# EAGLE design OwlClock2 (EAGLE 7.5.0)

## Sheet 1 of 3
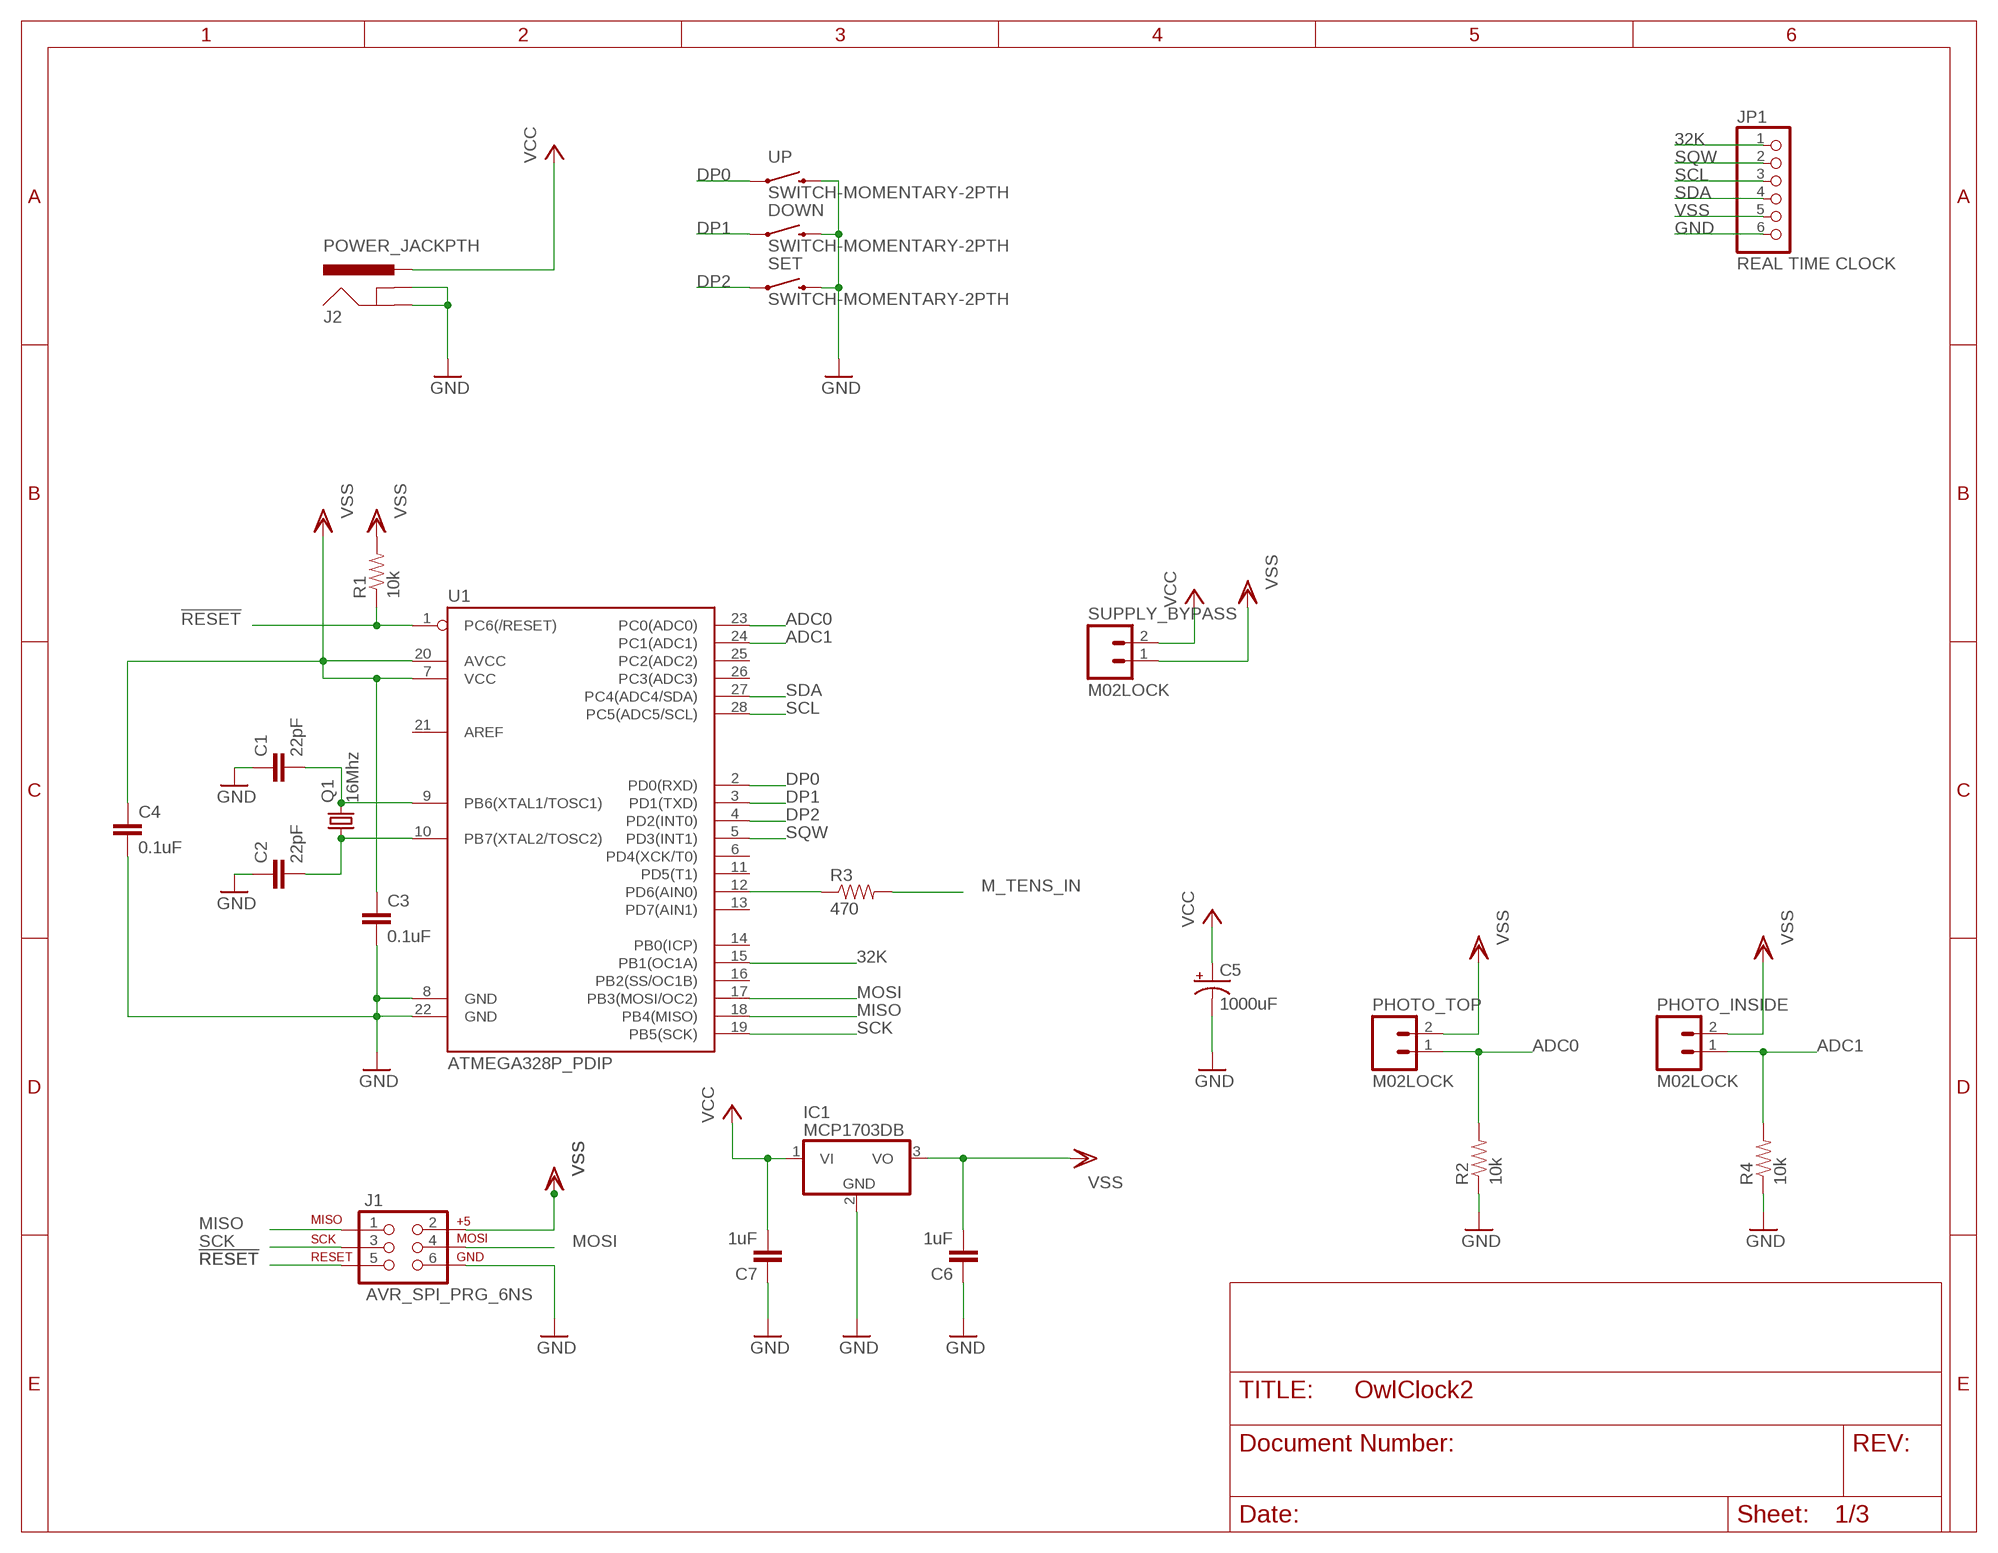
[diagram p0: schematic, sheet 1]

### Parts
C1  22pF  0.1UF-25V(+80/-20%)(0603)  [0603-CAP]
C2  22pF  0.1UF-25V(+80/-20%)(0603)  [0603-CAP]
C3  0.1uF  0.1UF-25V(+80/-20%)(0603)  [0603-CAP]
C4  0.1uF  0.1UF-25V(+80/-20%)(0603)  [0603-CAP]
C5  1000uF  CAP_POLPTH4  [CPOL-RADIAL-1000UF-25V]
C6  1uF  0.1UF-25V(+80/-20%)(0603)  [0603-CAP]
C7  1uF  0.1UF-25V(+80/-20%)(0603)  [0603-CAP]
DOWN  SWITCH-MOMENTARY-2PTH  [TACTILE-PTH]
IC1  MCP1703DB  [SOT223]
J1  AVR_SPI_PRG_6NS  [2X3-NS]
J2  POWER_JACKPTH  [POWER_JACK_PTH]
JP1  REAL TIME CLOCK  PINHD-1X6  [1X06]
PHOTO_INSIDE  M02LOCK  [1X02_LOCK]
PHOTO_TOP  M02LOCK  [1X02_LOCK]
Q1  16Mhz  CRYSTALHC18U-V  [HC18U-V]
R1  10k  0.22OHM1/4W1%(0805)  [0805]
R2  10k  0.22OHM1/4W1%(0805)  [0805]
R3  470  0.22OHM1/4W1%(0805)  [0805]
R4  10k  0.22OHM1/4W1%(0805)  [0805]
SET  SWITCH-MOMENTARY-2PTH  [TACTILE-PTH]
SUPPLY_BYPASS  M02LOCK  [1X02_LOCK]
U1  ATMEGA328P_PDIP  [DIL28-3]
UP  SWITCH-MOMENTARY-2PTH  [TACTILE-PTH]

### Nets
32K: JP1.1 U1.15(PB1(OC1A))
!RESET: J1.5 R1.1 U1.1(PC6(/RESET))
ADC0: PHOTO_TOP.1 R2.2 U1.23(PC0(ADC0))
ADC1: PHOTO_INSIDE.1 R4.2 U1.24(PC1(ADC1))
DP0: U1.2(PD0(RXD)) UP.1
DP1: DOWN.1 U1.3(PD1(TXD))
DP2: SET.1 U1.4(PD2(INT0))
GND: C1.1 C2.1 C3.2 C4.2 C5.2(-) C6.1 C7.1 DOWN.3 IC1.2(GND) J1.6 J2.GND J2.GNDBREAK JP1.6 R2.1 R4.1 SET.3 U1.8(GND) U1.22(GND) UP.3 ; also sheet 2,3
M_TENS_IN: R3.2 ; also sheet 3
MISO: J1.1 U1.18(PB4(MISO))
MOSI: J1.4 U1.17(PB3(MOSI/OC2))
N$2: R3.1 U1.12(PD6(AIN0))
N$17: C1.2 Q1.2 U1.9(PB6(XTAL1/TOSC1))
N$18: C2.2 Q1.1 U1.10(PB7(XTAL2/TOSC2))
SCK: J1.3 U1.19(PB5(SCK))
SCL: JP1.3 U1.28(PC5(ADC5/SCL))
SDA: JP1.4 U1.27(PC4(ADC4/SDA))
SQW: JP1.2 U1.5(PD3(INT1))
VCC: C5.1(+) C7.2 IC1.1(VI) J2.PWR SUPPLY_BYPASS.2 ; also sheet 2,3
VSS: C3.1 C4.1 C6.2 IC1.3(VO) J1.2 JP1.5 PHOTO_INSIDE.2 PHOTO_TOP.2 R1.2 SUPPLY_BYPASS.1 U1.7(VCC) U1.20(AVCC)
Unconnected: U1.6(PD4(XCK/T0)) U1.11(PD5(T1)) U1.13(PD7(AIN1)) U1.14(PB0(ICP)) U1.16(PB2(SS/OC1B)) U1.21(AREF) U1.25(PC2(ADC2)) U1.26(PC3(ADC3))

## Sheet 2 of 3
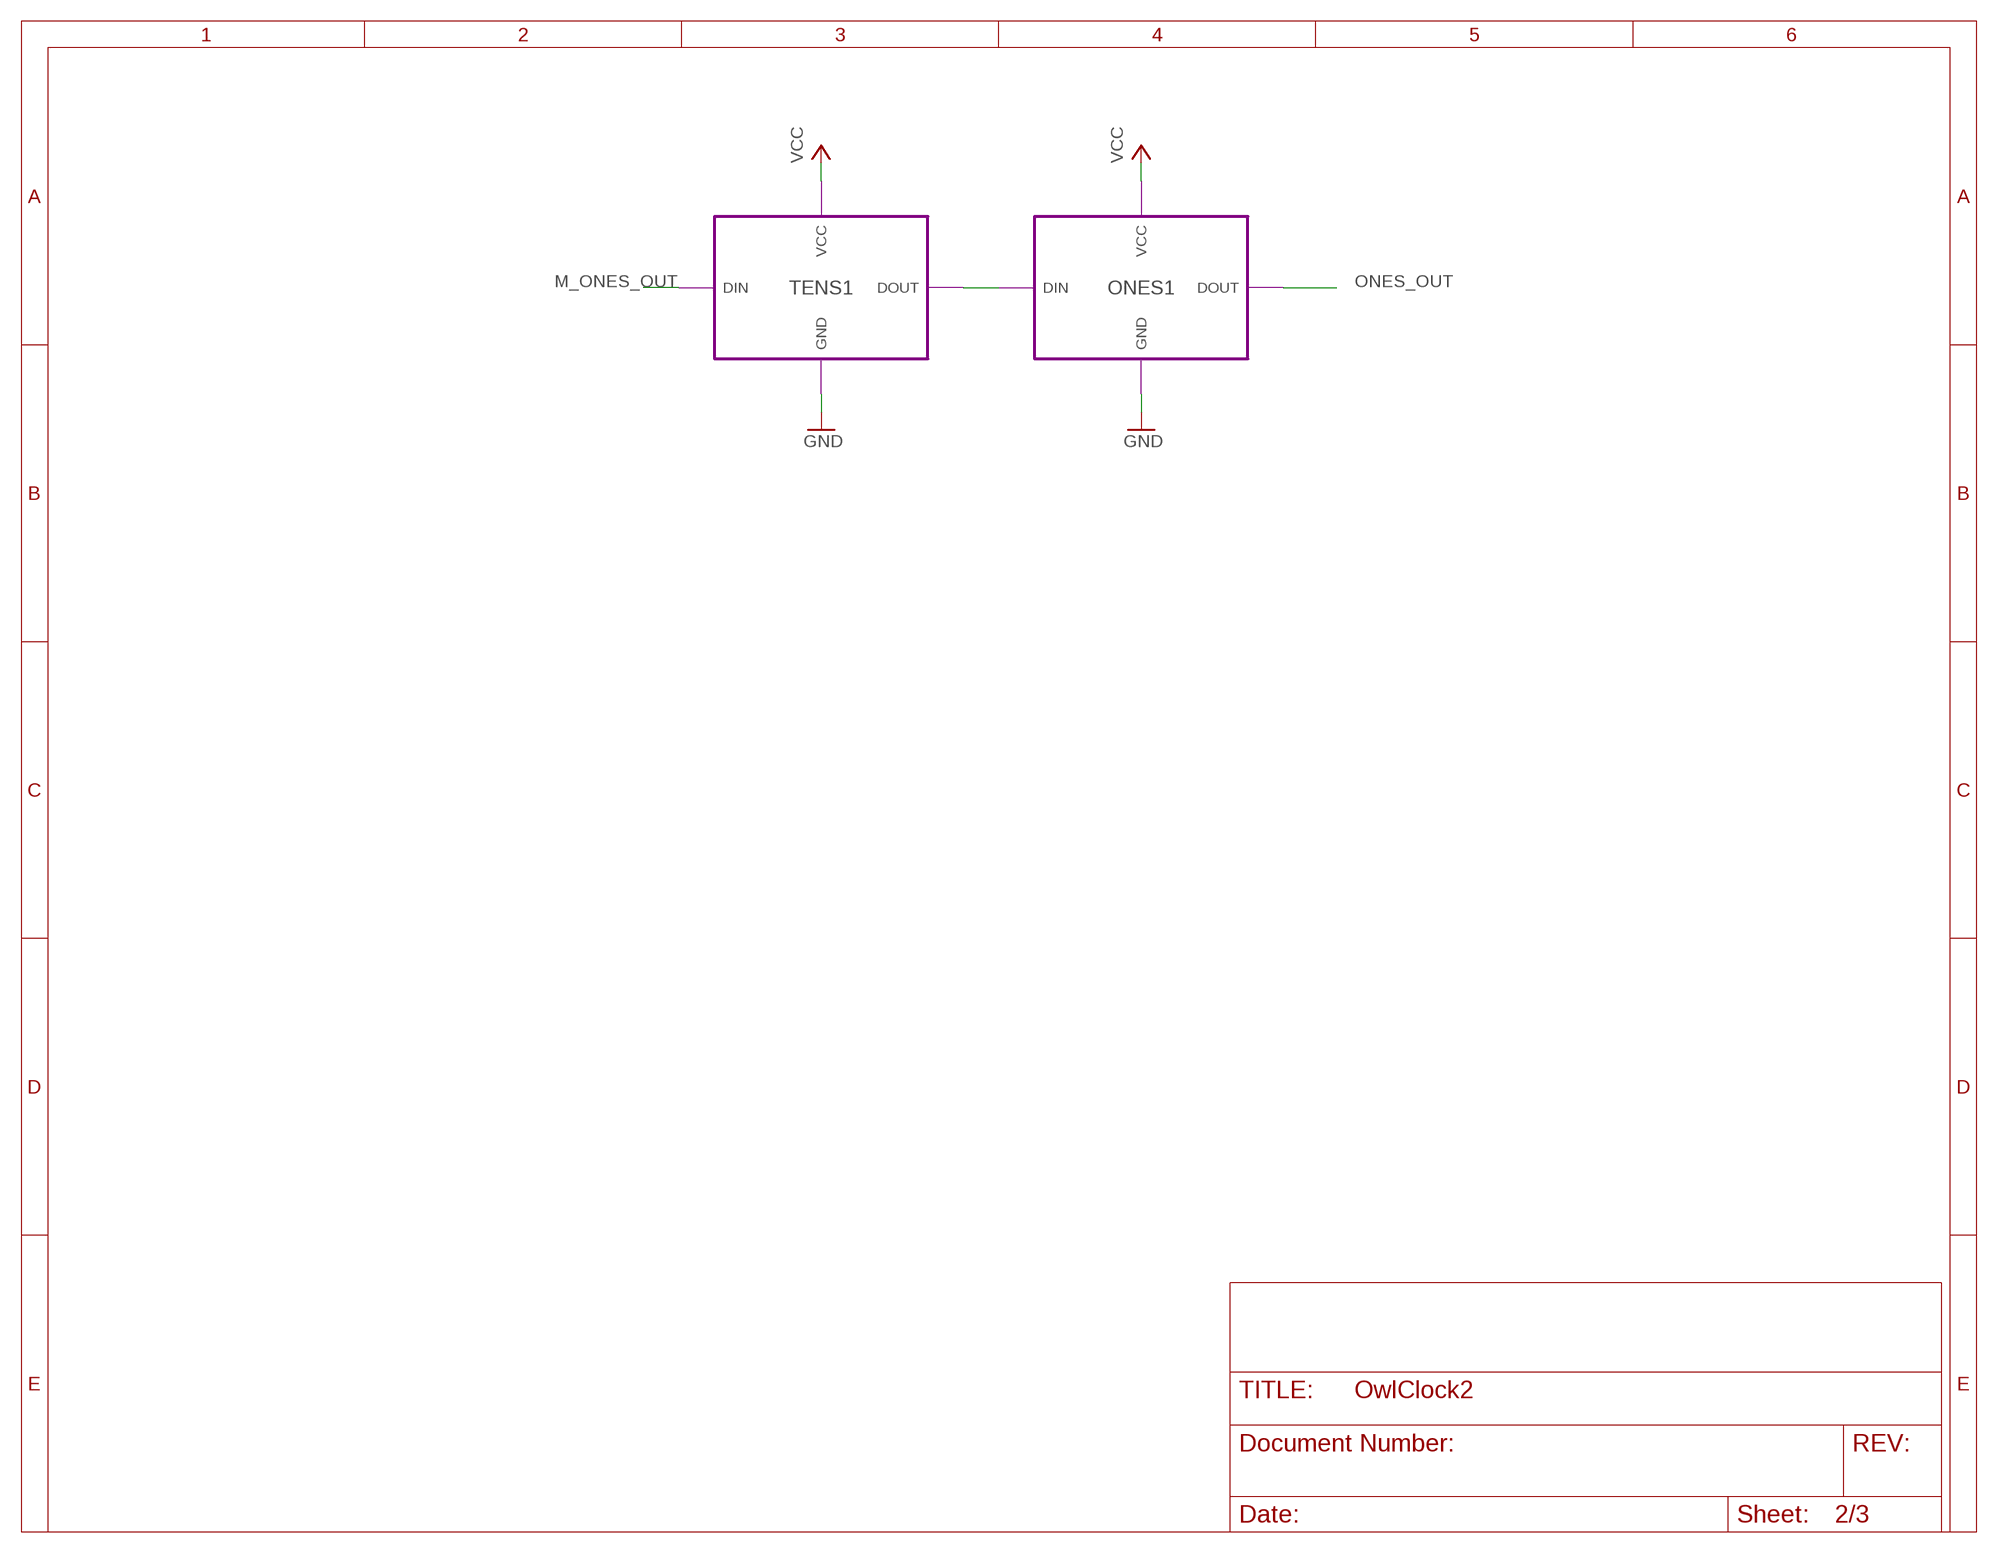
[diagram p1: schematic, sheet 2]

### Module instances
TENS1 = LEDS
ONES1 = LEDS

### Nets
GND: port TENS1.GND ONES1.GND ; also sheet 1,3
M_ONES_OUT: port TENS1.DIN ; also sheet 3
N$6: port TENS1.DOUT ONES1.DIN
ONES_OUT: port ONES1.DOUT
VCC: port TENS1.VCC ONES1.VCC ; also sheet 1,3

## Sheet 3 of 3
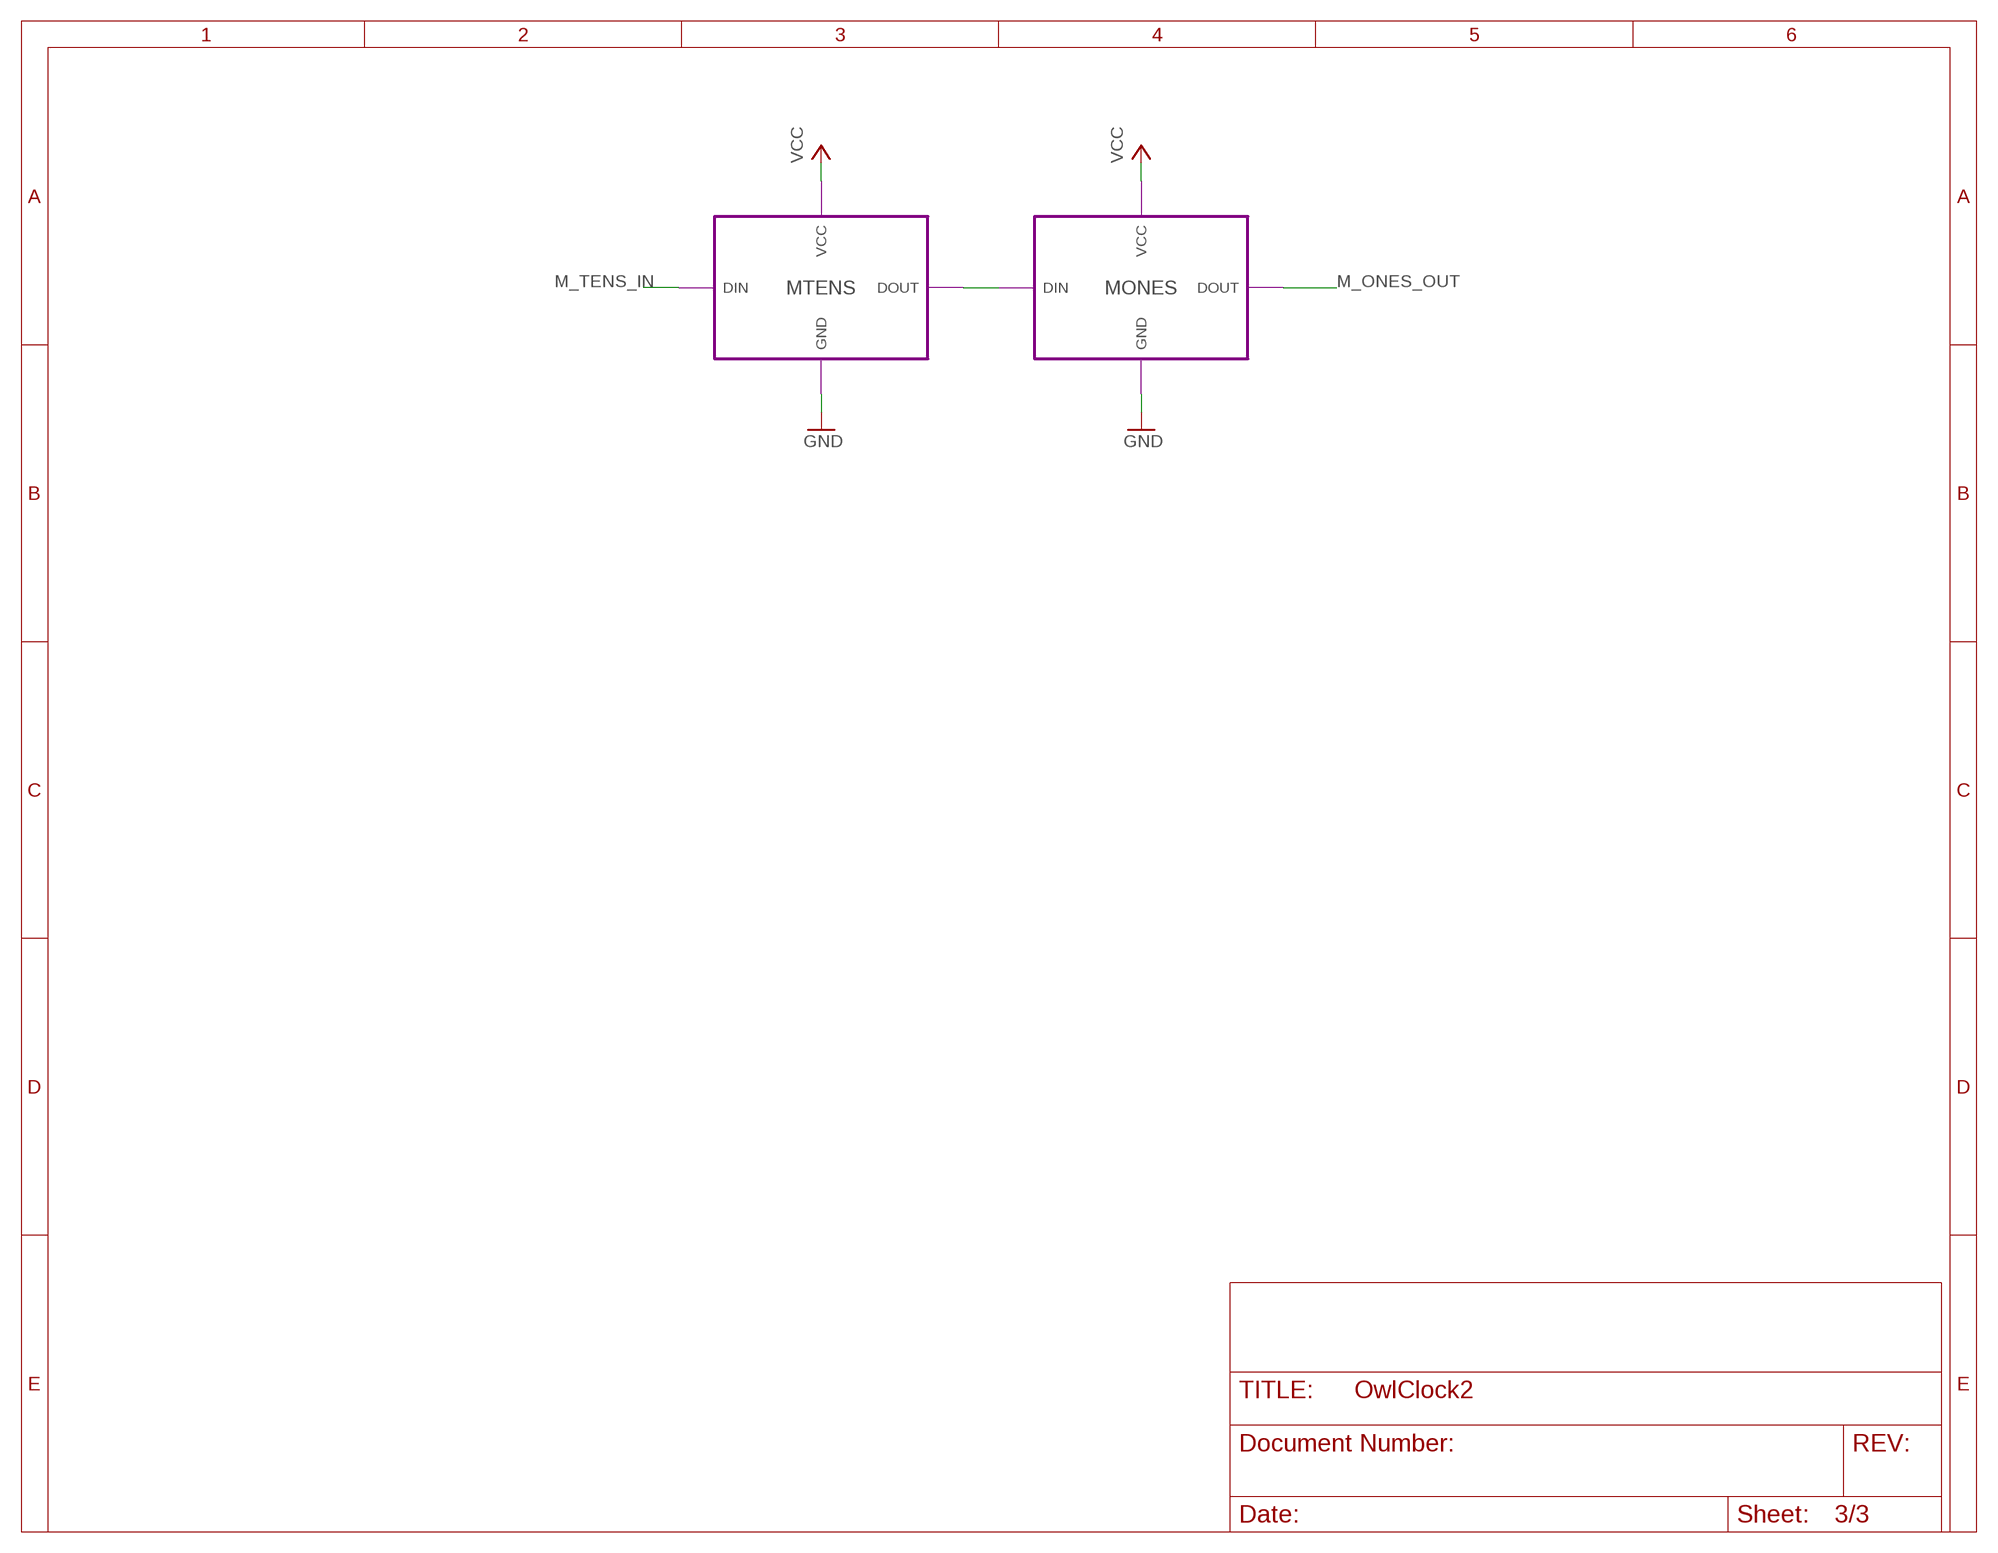
[diagram p2: schematic, sheet 3]

### Module instances
MTENS = LEDS
MONES = LEDS

### Nets
GND: port MTENS.GND MONES.GND ; also sheet 1,2
M_ONES_OUT: port MONES.DOUT ; also sheet 2
M_TENS_IN: port MTENS.DIN ; also sheet 1
N$1: port MTENS.DOUT MONES.DIN
VCC: port MTENS.VCC MONES.VCC ; also sheet 1,2

## Library data of the parts
C1 C2 C6 C7 = SparkFun-Capacitors:0.1UF-25V(+80/-20%)(0603): CAP-00810 Ceramic Standard decoupling cap; PROD_ID: CAP-00810; VALUE: 0.1uF
C3 C4 = SparkFun-Capacitors:0.1UF-25V(+80/-20%)(0603): CAP-00810 Ceramic Standard decoupling cap; PROD_ID: CAP-00810
C5 = SparkFun-Capacitors:CAP_POL: Capacitor Polarized These are standard SMD and PTH capacitors. Normally 10uF, 47uF, and 100uF in electrolytic and tantalum varieties. Always verify the external diameter of the through hole cap, it varies with capacity, voltage, and manufacturer. The EIA devices should be standard.
DOWN SET UP = SparkFun-Electromechanical:SWITCH-MOMENTARY-2: Various NO switches- pushbuttons, reed, etc
IC1 = linear:MCP1703: 250 mA, 16V, Low Quiescent Current LDO Regulator Source: http://ww1.microchip.com/downloads/en/DeviceDoc/22049b.pdf
J1 = SparkFun-Connectors:AVR_SPI_PRG_6: AVR ISP 6 Pin This is the reduced ISP connector for AVR programming. Common on Arduino. This footprint will take up less PCB space and can be used with a 10-pin to 6-pin adapter such as SKU: BOB-08508 **Special note about "TEST_POINT" package. The stop mask is on the top side, so if you want your programming test points to be on the bottom of your board, make sure to place this package on the bottom side of the board. This also ensure that the orientation to program from the bottom side will be correct.
J2 = SparkFun-Connectors:POWER_JACK: Power Jack This is the standard 5.5mm barrel jack for power. The PTH is the most common, proven, reliable, footprint. The Slot footprint only works if the mill layer is transmitted to the PCB fab house so be warned. Mating wall wart : TOL-00298 (and others); PROD_ID: PRT-00119
JP1 = adafruit:PINHD-1X6: PIN HEADER
PHOTO_INSIDE PHOTO_TOP SUPPLY_BYPASS = SparkFun-Connectors:M02: Standard 2-pin 0.1" header. Use with - straight break away headers ( PRT-00116) - right angle break away headers (PRT-00553) - swiss pins (PRT-00743) - machine pins (PRT-00117) - female headers (PRT-00115) Molex polarized connector foot print use with: PRT-08233 with associated crimp pins and housings. 2.54_SCREWTERM for use with PRT-10571. 3.5mm Screw Terminal footprints for PRT-08084 5mm Screw Terminal footprints for use with PRT-08433
Q1 = adafruit:CRYSTAL: CRYSTAL; OC_FARNELL: unknown; OC_NEWARK: unknown
R1-R4 = SparkFun-Resistors:0.22OHM1/4W1%(0805): RES-09883; PROD_ID: RES-09883; VALUE: 0.22
U1 = SparkFun-DigitalIC:ATMEGA328P_PDIP: uC used in the Arduino 32kb flash, 1k EEPROM, 2k SRAM This is the through-hole version of this chip.

## Module LED_MODULE
Ports: GND(io) DIN(io) DOUT(io) VCC(io)
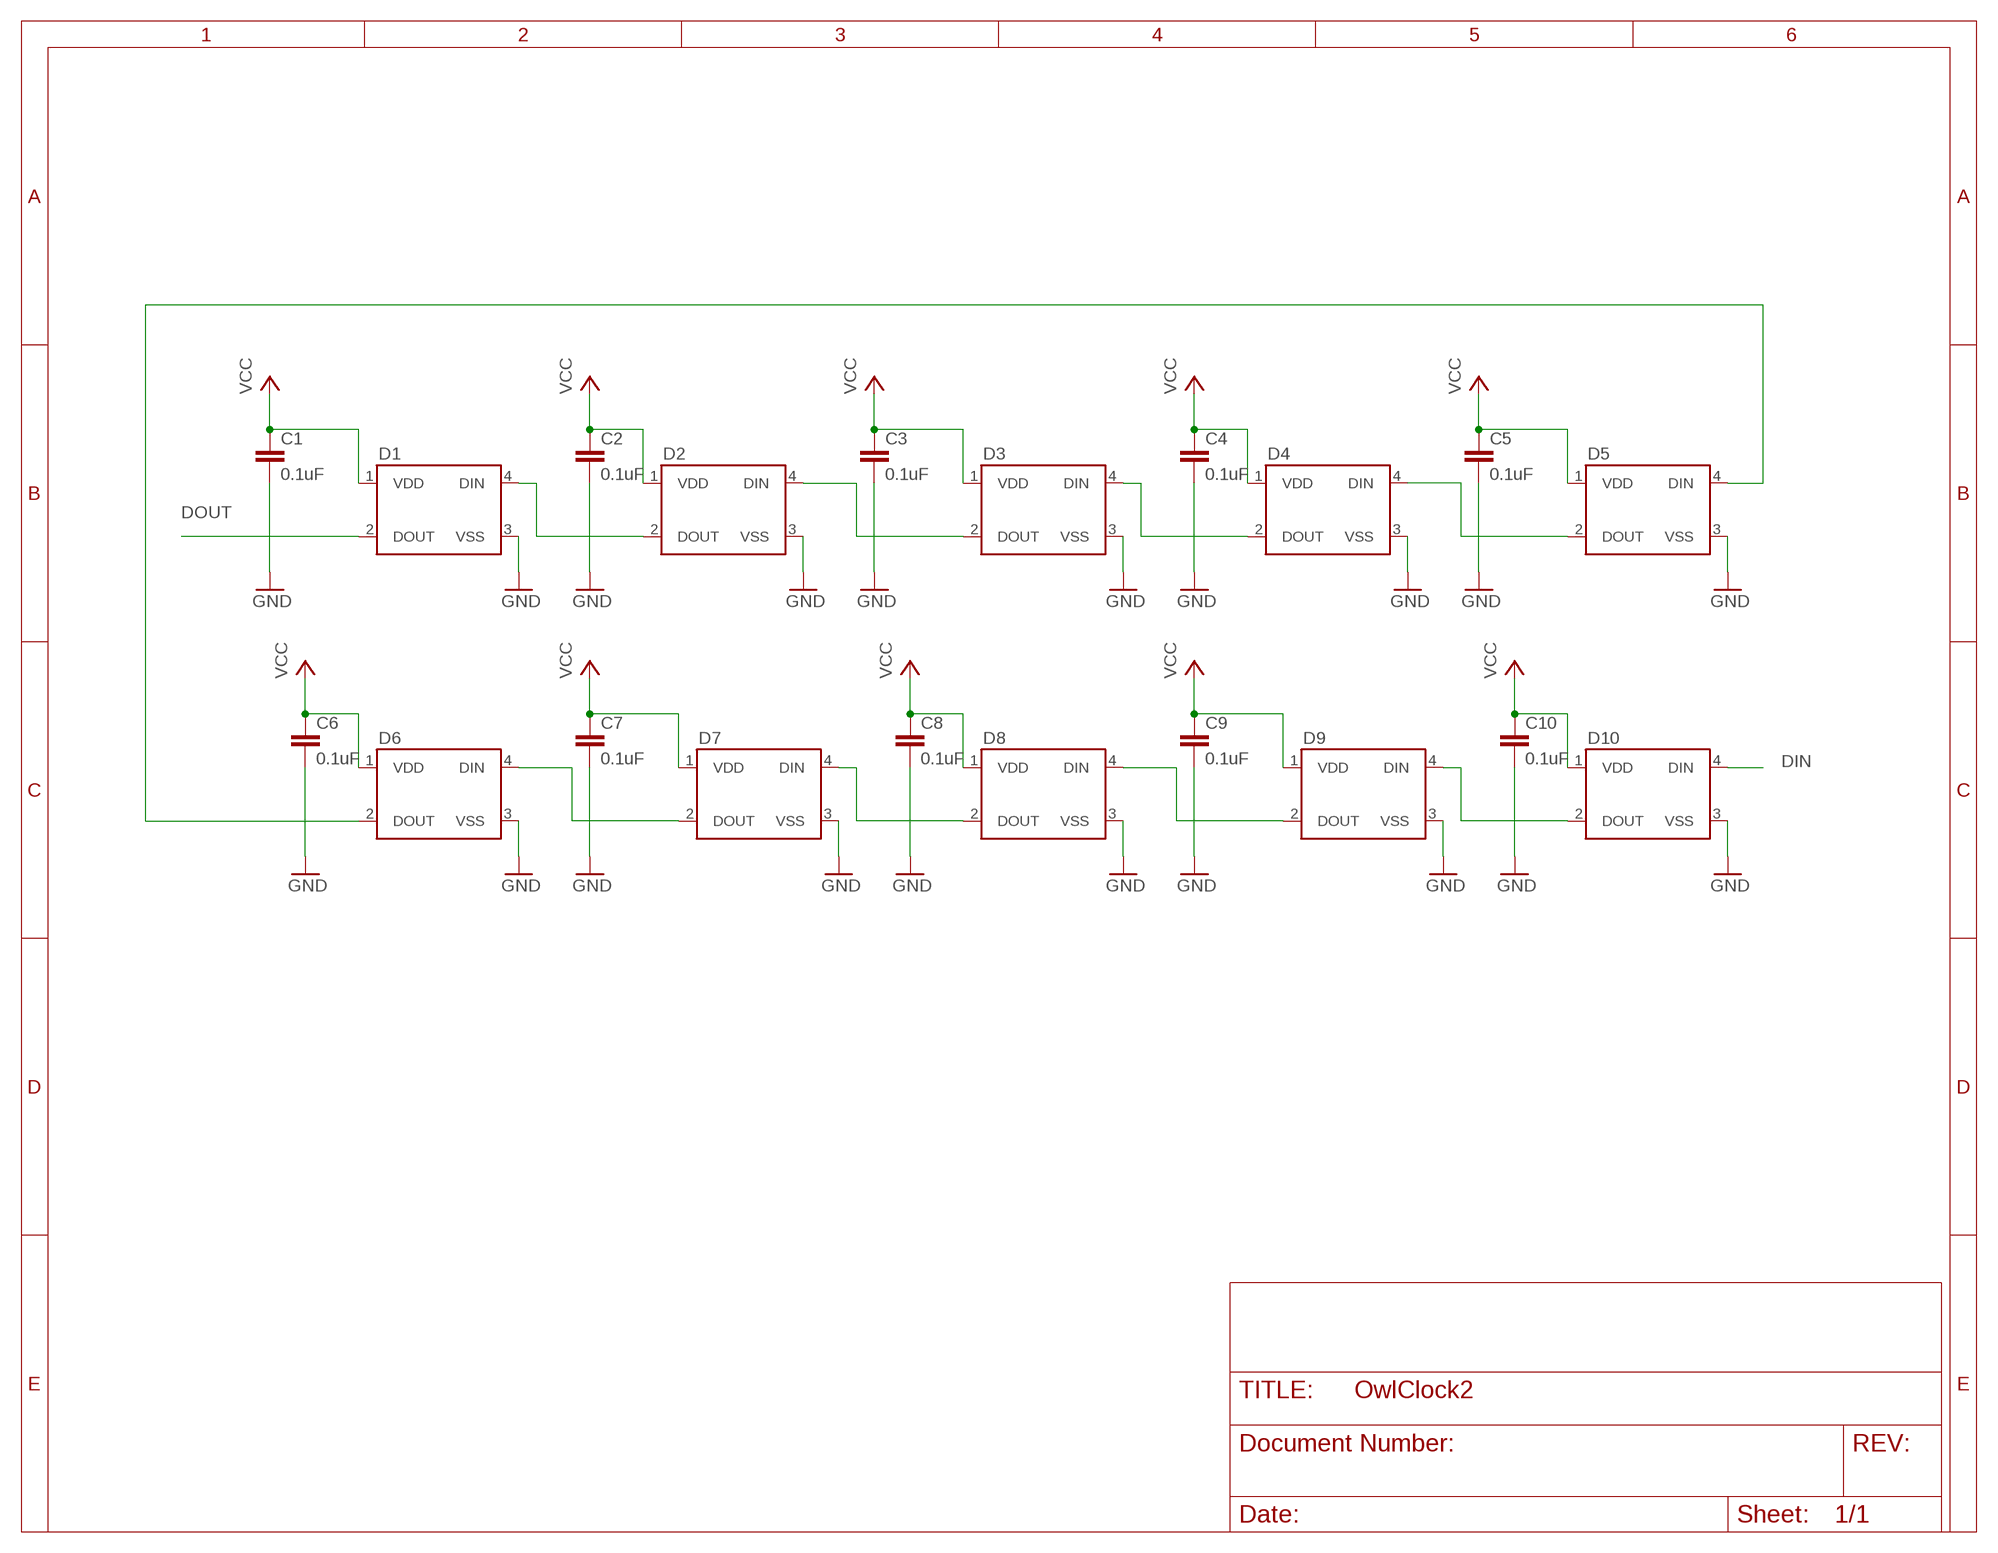
[diagram p3: schematic, module LED_MODULE, sheet 1]

### Parts
C1  0.1uF  0.1UF-25V(+80/-20%)(0603)  [0603-CAP]
C2  0.1uF  0.1UF-25V(+80/-20%)(0603)  [0603-CAP]
C3  0.1uF  0.1UF-25V(+80/-20%)(0603)  [0603-CAP]
C4  0.1uF  0.1UF-25V(+80/-20%)(0603)  [0603-CAP]
C5  0.1uF  0.1UF-25V(+80/-20%)(0603)  [0603-CAP]
C6  0.1uF  0.1UF-25V(+80/-20%)(0603)  [0603-CAP]
C7  0.1uF  0.1UF-25V(+80/-20%)(0603)  [0603-CAP]
C8  0.1uF  0.1UF-25V(+80/-20%)(0603)  [0603-CAP]
C9  0.1uF  0.1UF-25V(+80/-20%)(0603)  [0603-CAP]
C10  0.1uF  0.1UF-25V(+80/-20%)(0603)  [0603-CAP]
D1  WS2812B  [WS2812B]
D2  WS2812B  [WS2812B]
D3  WS2812B  [WS2812B]
D4  WS2812B  [WS2812B]
D5  WS2812B  [WS2812B]
D6  WS2812B  [WS2812B]
D7  WS2812B  [WS2812B]
D8  WS2812B  [WS2812B]
D9  WS2812B  [WS2812B]
D10  WS2812B  [WS2812B]

### Nets
DIN: D10.4(DIN)
DOUT: D1.2(DOUT)
GND: C1.2 C2.2 C3.2 C4.2 C5.2 C6.2 C7.2 C8.2 C9.2 C10.2 D1.3(VSS) D2.3(VSS) D3.3(VSS) D4.3(VSS) D5.3(VSS) D6.3(VSS) D7.3(VSS) D8.3(VSS) D9.3(VSS) D10.3(VSS)
N$1: D2.4(DIN) D3.2(DOUT)
N$5: D1.4(DIN) D2.2(DOUT)
N$6: D3.4(DIN) D4.2(DOUT)
N$7: D4.4(DIN) D5.2(DOUT)
N$9: D5.4(DIN) D6.2(DOUT)
N$10: D6.4(DIN) D7.2(DOUT)
N$12: D7.4(DIN) D8.2(DOUT)
N$13: D8.4(DIN) D9.2(DOUT)
N$15: D9.4(DIN) D10.2(DOUT)
VCC: C1.1 C2.1 C3.1 C4.1 C5.1 C6.1 C7.1 C8.1 C9.1 C10.1 D1.1(VDD) D2.1(VDD) D3.1(VDD) D4.1(VDD) D5.1(VDD) D6.1(VDD) D7.1(VDD) D8.1(VDD) D9.1(VDD) D10.1(VDD)

### Library data of the parts
C1-C10 = SparkFun-Capacitors:0.1UF-25V(+80/-20%)(0603): CAP-00810 Ceramic Standard decoupling cap; PROD_ID: CAP-00810
D1-D10 = SparkFun-LED:WS2812B: WS2812B - Intelligent control LED integrated light source Technical Specifications: Power Supply Voltage (VDD): 3.5 to 5.3 V Input Voltage (VI): -0.5 to VDD+0.5 V Operating Junction Temperature (Topt): -25°C to +80°C Storage Temperature Range (Tstg): -55°C to +150°C

## Module LEDS
Ports: GND(pwr) VCC(pwr) DOUT(out) DIN(in)
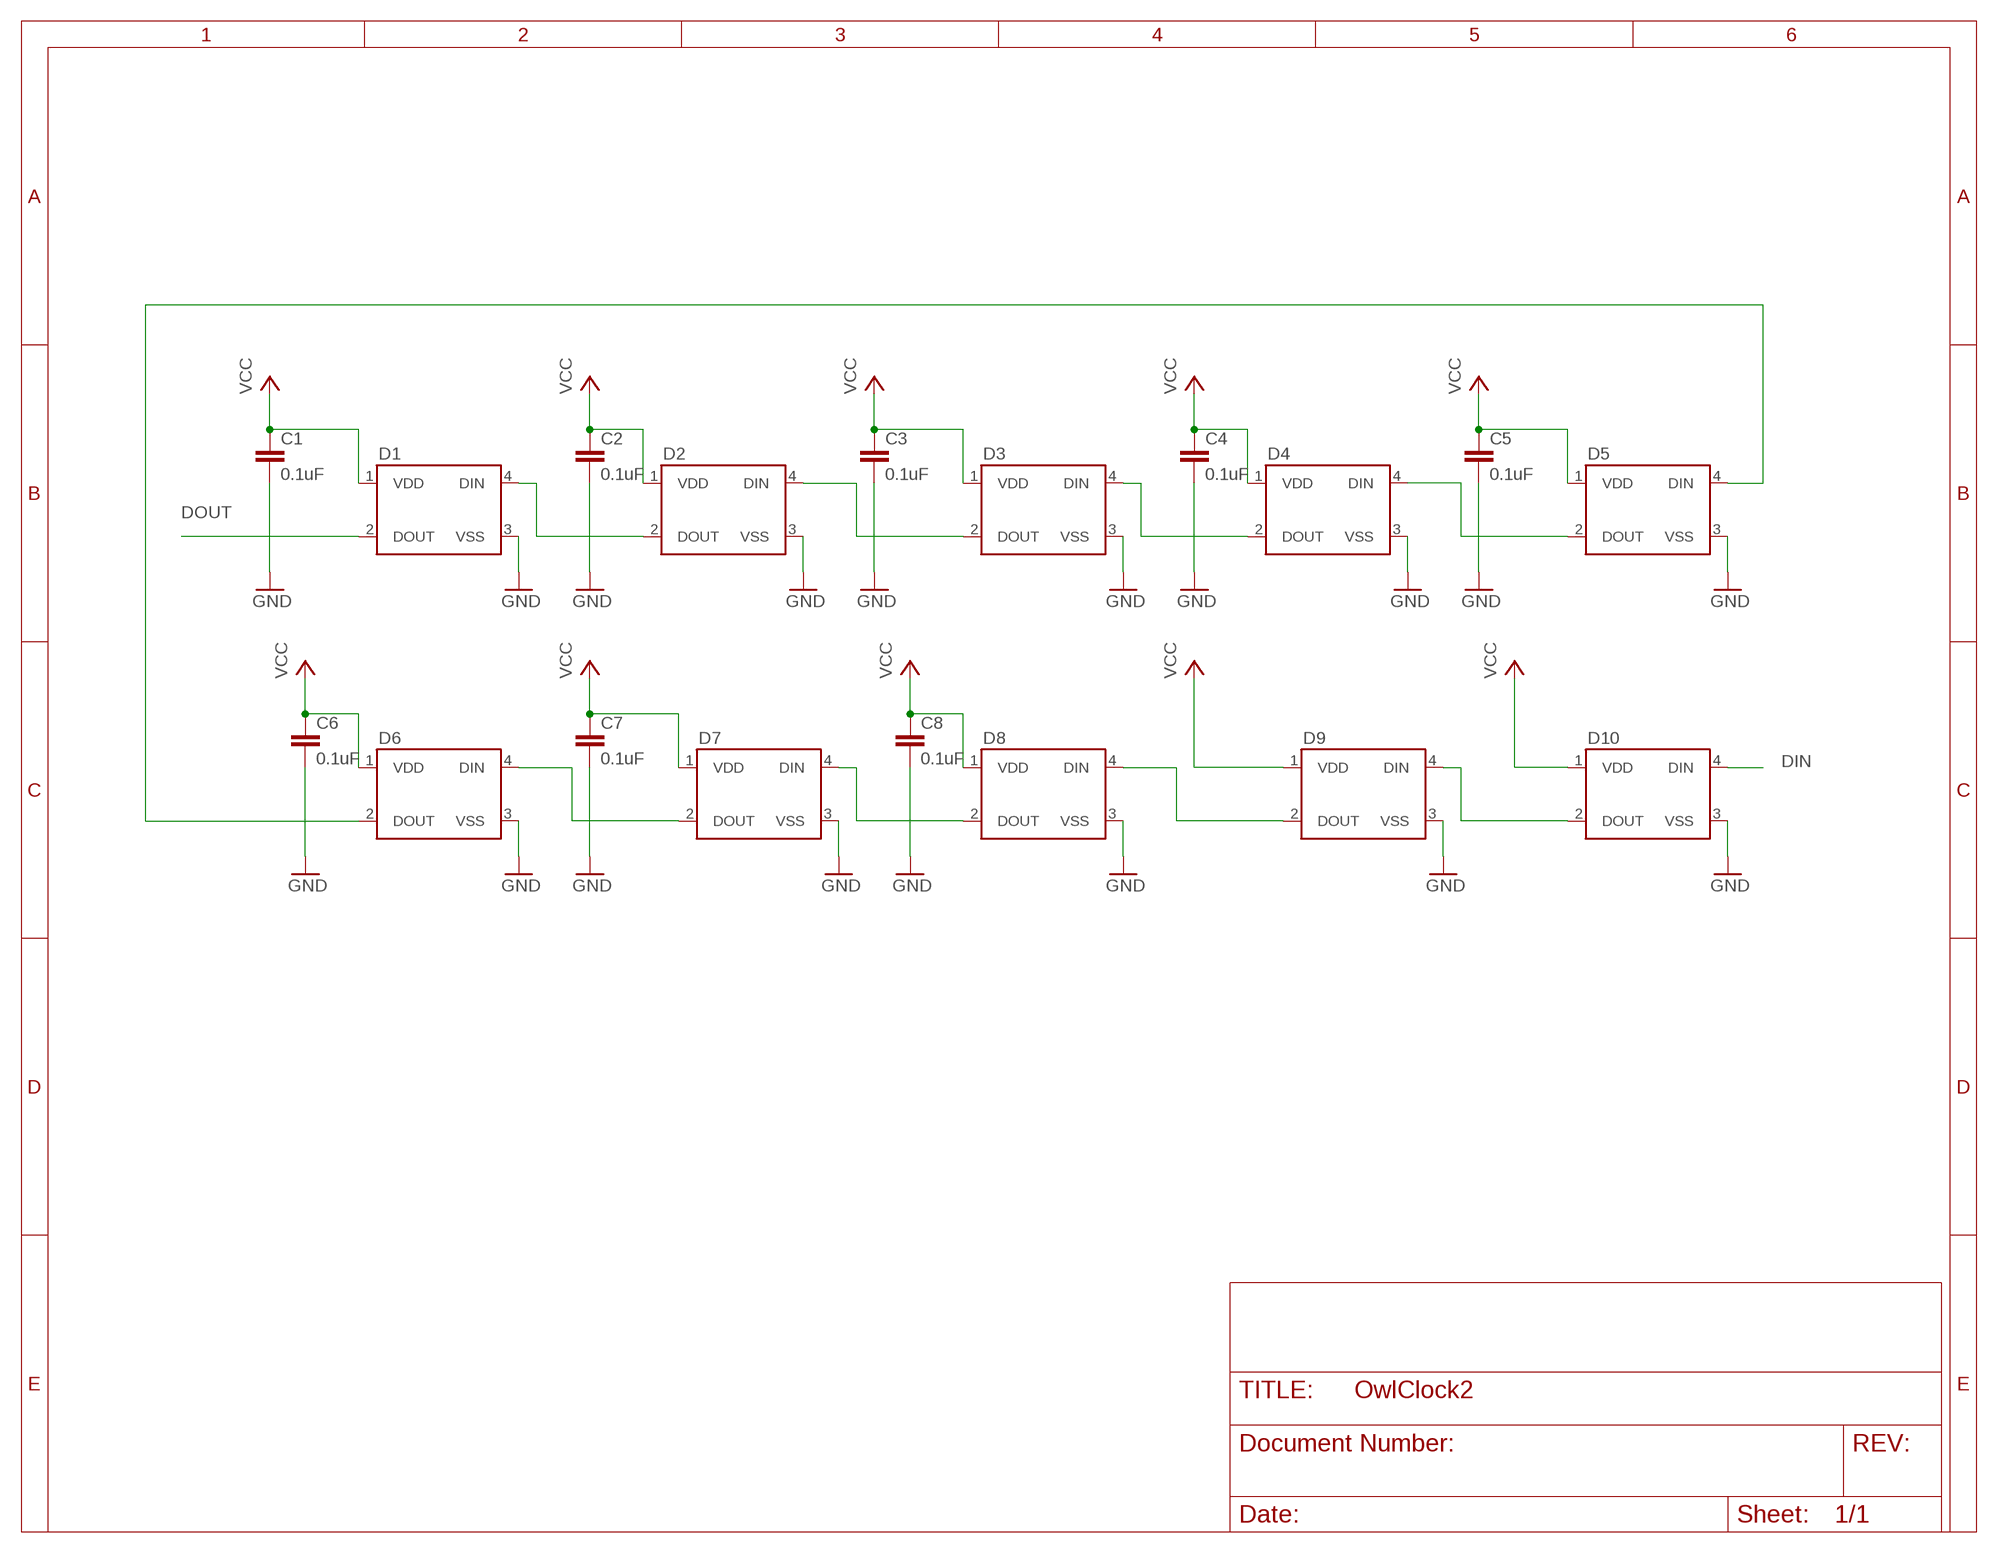
[diagram p4: schematic, module LEDS, sheet 1]

### Parts
C1  0.1uF  0.1UF-25V(+80/-20%)(0603)  [0603-CAP]
C2  0.1uF  0.1UF-25V(+80/-20%)(0603)  [0603-CAP]
C3  0.1uF  0.1UF-25V(+80/-20%)(0603)  [0603-CAP]
C4  0.1uF  0.1UF-25V(+80/-20%)(0603)  [0603-CAP]
C5  0.1uF  0.1UF-25V(+80/-20%)(0603)  [0603-CAP]
C6  0.1uF  0.1UF-25V(+80/-20%)(0603)  [0603-CAP]
C7  0.1uF  0.1UF-25V(+80/-20%)(0603)  [0603-CAP]
C8  0.1uF  0.1UF-25V(+80/-20%)(0603)  [0603-CAP]
D1  WS2812B  [WS2812B]
D2  WS2812B  [WS2812B]
D3  WS2812B  [WS2812B]
D4  WS2812B  [WS2812B]
D5  WS2812B  [WS2812B]
D6  WS2812B  [WS2812B]
D7  WS2812B  [WS2812B]
D8  WS2812B  [WS2812B]
D9  WS2812B  [WS2812B]
D10  WS2812B  [WS2812B]

### Nets
DIN: D10.4(DIN)
DOUT: D1.2(DOUT)
GND: C1.2 C2.2 C3.2 C4.2 C5.2 C6.2 C7.2 C8.2 D1.3(VSS) D2.3(VSS) D3.3(VSS) D4.3(VSS) D5.3(VSS) D6.3(VSS) D7.3(VSS) D8.3(VSS) D9.3(VSS) D10.3(VSS)
N$1: D2.4(DIN) D3.2(DOUT)
N$5: D1.4(DIN) D2.2(DOUT)
N$6: D3.4(DIN) D4.2(DOUT)
N$7: D4.4(DIN) D5.2(DOUT)
N$9: D5.4(DIN) D6.2(DOUT)
N$10: D6.4(DIN) D7.2(DOUT)
N$12: D7.4(DIN) D8.2(DOUT)
N$13: D8.4(DIN) D9.2(DOUT)
N$15: D9.4(DIN) D10.2(DOUT)
VCC: C1.1 C2.1 C3.1 C4.1 C5.1 C6.1 C7.1 C8.1 D1.1(VDD) D2.1(VDD) D3.1(VDD) D4.1(VDD) D5.1(VDD) D6.1(VDD) D7.1(VDD) D8.1(VDD) D9.1(VDD) D10.1(VDD)

### Library data of the parts
C1-C8 = SparkFun-Capacitors:0.1UF-25V(+80/-20%)(0603): CAP-00810 Ceramic Standard decoupling cap; PROD_ID: CAP-00810
D1-D10 = SparkFun-LED:WS2812B: WS2812B - Intelligent control LED integrated light source Technical Specifications: Power Supply Voltage (VDD): 3.5 to 5.3 V Input Voltage (VI): -0.5 to VDD+0.5 V Operating Junction Temperature (Topt): -25°C to +80°C Storage Temperature Range (Tstg): -55°C to +150°C

## Board
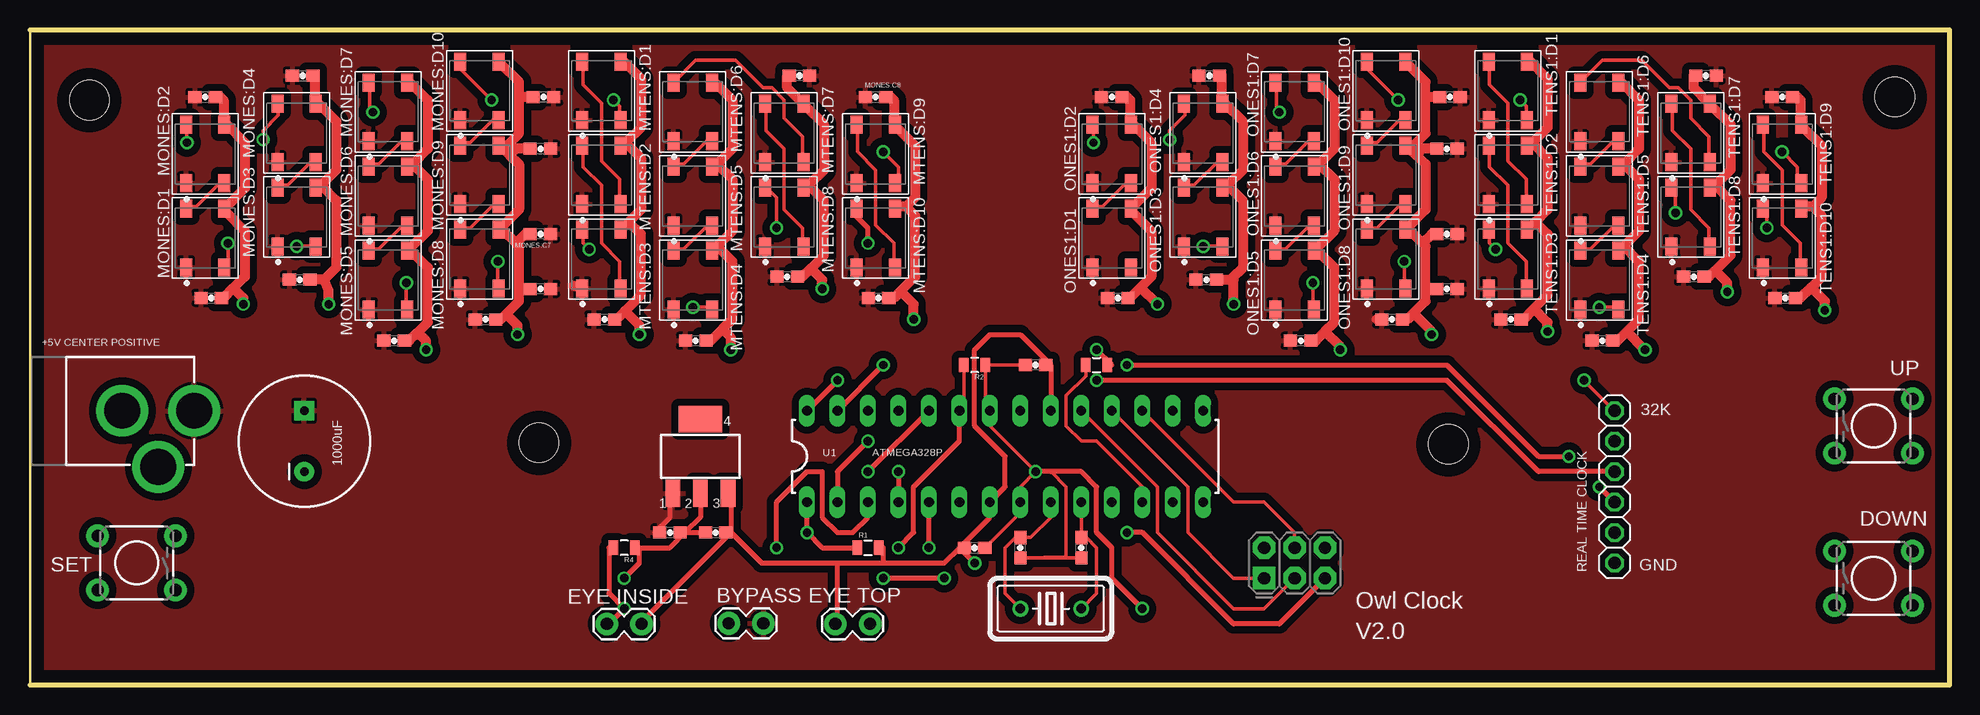
[diagram p5: board, top side]
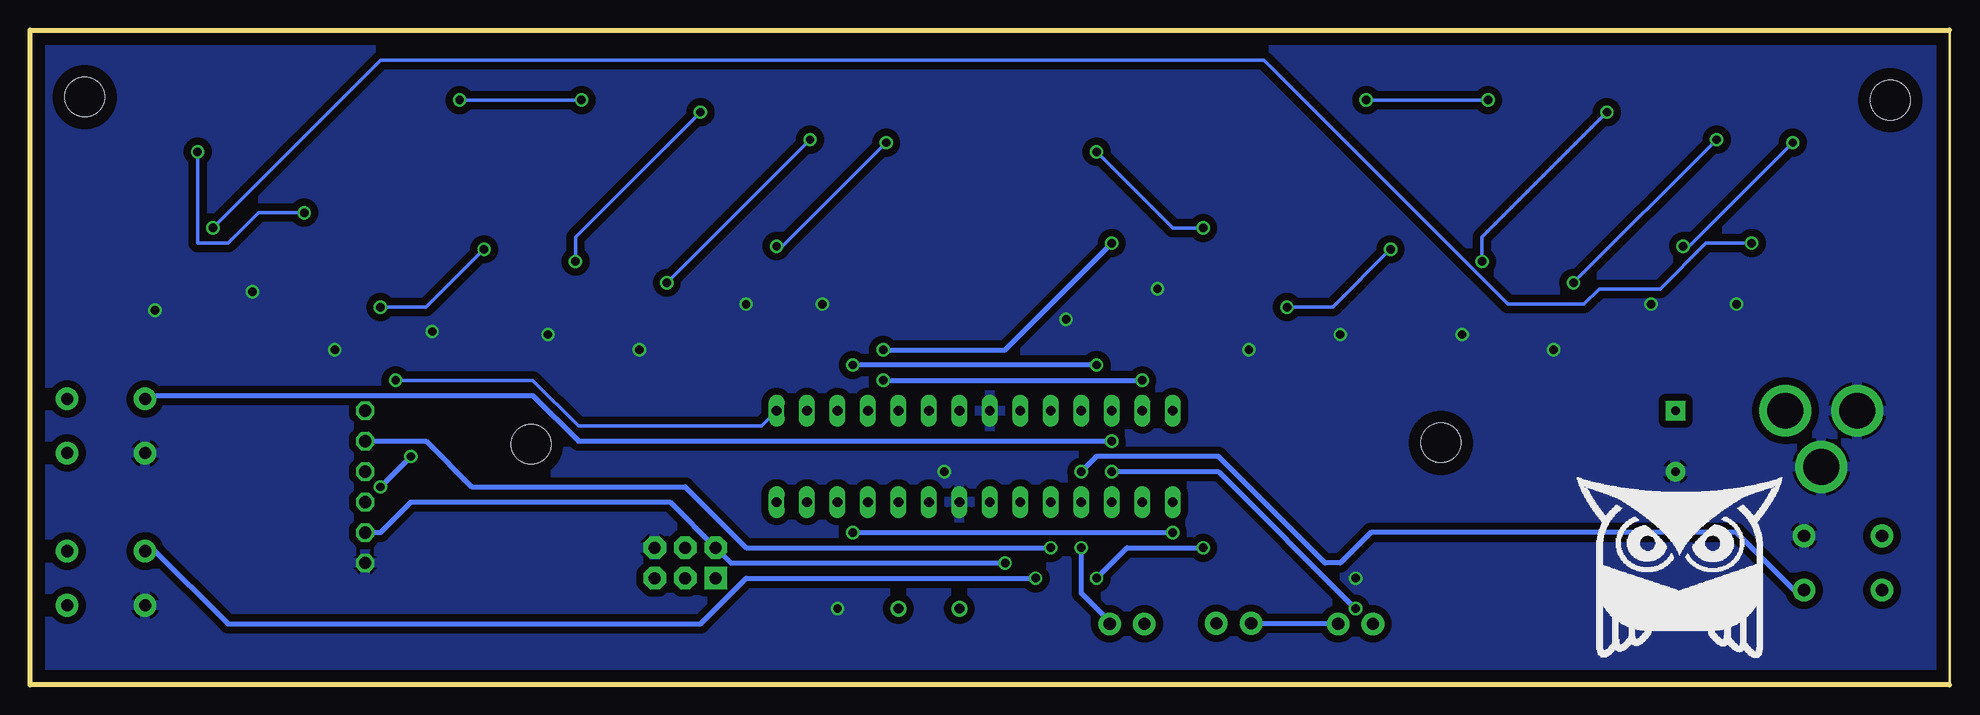
[diagram p6: board, bottom side, seen from below]

Size 160.02 x 54.61 mm. Coordinates in mm from the lower left corner, seen from the top.
Outline: 0,54.61 0,0 160.02,0 160.02,54.61 0,54.61
Copper layers (1*16): Top 0.035mm / dielectric 1.5mm / Bottom 0.035mm
Design rules "default *": minimum track width 10mil, minimum drill 24mil, track to track 8mil, track to pad 8mil, pad to pad 8mil, via to via 8mil, smd to smd 8mil, copper to edge 40mil, drill to drill 8mil, minimum pad ring 10mil, minimum via ring 8mil, stop-mask expansion 4mil, vias tented up to drill 28mil, thermal gap 10mil

### Footprints (pad centres in the part's own frame; a part is rotated, then mirrored left to right if it is on the bottom)
0603-CAP = smd 1.1 x 1: 1 -0.85,0; 2 0.85,0
CPOL-RADIAL-1000UF-25V = drill 0.7 pad 1.651 square: 1 2.54,0 | drill 0.7 pad 1.651: 2 -2.54,0
TACTILE-PTH = drill 1.016 pad 1.88: 1 -3.251,2.261; 2 3.251,2.261; 3 -3.251,-2.261; 4 3.251,-2.261
SOT223 = smd 1.219 x 2.235: 1 -2.311,-3.099; 2 0,-3.099; 3 2.311,-3.099 | smd 3.6 x 2.2: 4 0,3.099
2X3-NS = drill 1.016 pad 1.88 square: 1 -2.54,-1.27 | drill 1.016 pad 1.88 octagon: 2 -2.54,1.27; 3 0,-1.27; 4 0,1.27; 5 2.54,-1.27; 6 2.54,1.27
POWER_JACK_PTH = drill 2.997 pad 4.318: GND 0,7.7; GNDBREAK 4.7,10.7; PWR 0,13.7
1X06 = drill 1.016 octagon: 1 -6.35,0; 2 -3.81,0; 3 -1.27,0; 4 1.27,0; 5 3.81,0; 6 6.35,0
WS2812B = smd 1.5 x 1: 1 -2.45,1.6; 2 -2.45,-1.6; 3 2.45,-1.6; 4 2.45,1.6
1X02_LOCK = drill 1.016 pad 1.88: 1 -0.178,0; 2 2.718,0
HC18U-V = drill 0.813: 1 -2.54,0; 2 2.54,0
0805 = smd 0.8 x 1.2: 1 -0.9,0; 2 0.9,0
DIL28-3 = drill 0.813 long: 1 -16.51,-3.81; 2 -13.97,-3.81; 3 -11.43,-3.81; 4 -8.89,-3.81; 5 -6.35,-3.81; 6 -3.81,-3.81; 7 -1.27,-3.81; 8 1.27,-3.81; 9 3.81,-3.81; 10 6.35,-3.81; 11 8.89,-3.81; 12 11.43,-3.81; 13 13.97,-3.81; 14 16.51,-3.81; 15 16.51,3.81; 16 13.97,3.81; 17 11.43,3.81; 18 8.89,3.81; 19 6.35,3.81; 20 3.81,3.81; 21 1.27,3.81; 22 -1.27,3.81; 23 -3.81,3.81; 24 -6.35,3.81; 25 -8.89,3.81; 26 -11.43,3.81; 27 -13.97,3.81; 28 -16.51,3.81
STAND-OFF = hole 3.302: 0,0

### Placement (x,y rotation side)
C1  82.55,11.43 90 top
C2  87.63,11.43 90 top
C3  78.74,11.43 0 top
C4  83.82,26.67 180 top
C5  22.86,20.32 90 top
C6  57.15,12.7 0 top
C7  53.34,12.7 180 top
DOWN  153.67,8.89 0 top
IC1  55.88,19.05 0 top
J1  105.41,10.16 0 top
J2  0,22.86 270 top
JP1  132.08,16.51 270 top
MONES:C1  0.1uF  [0603-CAP]  15.11,32.26 0 top
MONES:C2  0.1uF  [0603-CAP]  22.48,33.78 0 top
MONES:C3  0.1uF  [0603-CAP]  30.35,28.7 0 top
MONES:C4  0.1uF  [0603-CAP]  37.97,30.48 0 top
MONES:C5  0.1uF  [0603-CAP]  14.61,49.02 0 top
MONES:C6  0.1uF  [0603-CAP]  22.73,50.8 0 top
MONES:C7  0.1uF  [0603-CAP]  42.55,37.59 180 top
MONES:C8  0.1uF  [0603-CAP]  70.48,49.02 0 top
MONES:D1  [WS2812B]  14.61,37.26 90 top
MONES:D2  [WS2812B]  14.61,44.27 90 top
MONES:D3  [WS2812B]  22.23,39.01 90 top
MONES:D4  [WS2812B]  22.23,46.02 90 top
MONES:D5  [WS2812B]  29.84,33.76 90 top
MONES:D6  [WS2812B]  29.84,40.77 90 top
MONES:D7  [WS2812B]  29.84,47.78 90 top
MONES:D8  [WS2812B]  37.47,35.51 90 top
MONES:D9  [WS2812B]  37.47,42.52 90 top
MONES:D10  [WS2812B]  37.47,49.53 90 top
MTENS:C1  0.1uF  [0603-CAP]  42.8,49.02 180 top
MTENS:C2  0.1uF  [0603-CAP]  42.55,44.7 180 top
MTENS:C3  0.1uF  [0603-CAP]  42.55,33.02 180 top
MTENS:C4  0.1uF  [0603-CAP]  47.88,30.48 0 top
MTENS:C5  0.1uF  [0603-CAP]  55.5,28.7 0 top
MTENS:C6  0.1uF  [0603-CAP]  63.12,34.04 0 top
MTENS:C7  0.1uF  [0603-CAP]  70.74,32.26 0 top
MTENS:C8  0.1uF  [0603-CAP]  64.14,50.8 180 top
MTENS:D1  [WS2812B]  47.62,49.53 90 top
MTENS:D2  [WS2812B]  47.62,42.52 90 top
MTENS:D3  [WS2812B]  47.62,35.51 90 top
MTENS:D4  [WS2812B]  55.24,33.76 90 top
MTENS:D5  [WS2812B]  55.24,40.77 90 top
MTENS:D6  [WS2812B]  55.24,47.78 90 top
MTENS:D7  [WS2812B]  62.87,46.02 90 top
MTENS:D8  [WS2812B]  62.87,39.01 90 top
MTENS:D9  [WS2812B]  70.48,44.27 90 top
MTENS:D10  [WS2812B]  70.48,37.26 90 top
ONES1:C1  0.1uF  [0603-CAP]  90.68,32.26 0 top
ONES1:C2  0.1uF  [0603-CAP]  98.04,33.78 0 top
ONES1:C3  0.1uF  [0603-CAP]  105.92,28.7 0 top
ONES1:C4  0.1uF  [0603-CAP]  113.54,30.48 0 top
ONES1:C5  0.1uF  [0603-CAP]  90.17,49.02 0 top
ONES1:C6  0.1uF  [0603-CAP]  98.3,50.8 0 top
ONES1:C7  0.1uF  [0603-CAP]  118.11,37.59 180 top
ONES1:C8  0.1uF  [0603-CAP]  146.05,49.02 0 top
ONES1:D1  [WS2812B]  90.17,37.26 90 top
ONES1:D2  [WS2812B]  90.17,44.27 90 top
ONES1:D3  [WS2812B]  97.79,39.01 90 top
ONES1:D4  [WS2812B]  97.79,46.02 90 top
ONES1:D5  [WS2812B]  105.41,33.76 90 top
ONES1:D6  [WS2812B]  105.41,40.77 90 top
ONES1:D7  [WS2812B]  105.41,47.78 90 top
ONES1:D8  [WS2812B]  113.03,35.51 90 top
ONES1:D9  [WS2812B]  113.03,42.52 90 top
ONES1:D10  [WS2812B]  113.03,49.53 90 top
PHOTO_INSIDE  48.26,5.08 0 top
PHOTO_TOP  69.85,5.08 180 top
Q1  85.09,6.35 180 top
R1  69.85,11.43 0 top
R2  78.74,26.67 180 top
R3  88.9,26.67 0 top
R4  49.53,11.43 180 top
SET  8.89,10.16 180 top
SUPPLY_BYPASS  58.41,5.13 0 top
TENS1:C1  0.1uF  [0603-CAP]  118.36,49.02 180 top
TENS1:C2  0.1uF  [0603-CAP]  118.11,44.7 180 top
TENS1:C3  0.1uF  [0603-CAP]  118.11,33.02 180 top
TENS1:C4  0.1uF  [0603-CAP]  123.44,30.48 0 top
TENS1:C5  0.1uF  [0603-CAP]  131.06,28.7 0 top
TENS1:C6  0.1uF  [0603-CAP]  138.68,34.04 0 top
TENS1:C7  0.1uF  [0603-CAP]  146.3,32.26 0 top
TENS1:C8  0.1uF  [0603-CAP]  139.7,50.8 180 top
TENS1:D1  [WS2812B]  123.19,49.53 90 top
TENS1:D2  [WS2812B]  123.19,42.52 90 top
TENS1:D3  [WS2812B]  123.19,35.51 90 top
TENS1:D4  [WS2812B]  130.81,33.76 90 top
TENS1:D5  [WS2812B]  130.81,40.77 90 top
TENS1:D6  [WS2812B]  130.81,47.78 90 top
TENS1:D7  [WS2812B]  138.43,46.02 90 top
TENS1:D8  [WS2812B]  138.43,39.01 90 top
TENS1:D9  [WS2812B]  146.05,44.27 90 top
TENS1:D10  [WS2812B]  146.05,37.26 90 top
U1  81.28,19.05 0 top
U$1  [STAND-OFF]  4.95,48.77 0 top
U$2  [STAND-OFF]  118.24,20.07 0 top
U$3  [STAND-OFF]  42.42,20.19 0 top
U$4  [STAND-OFF]  155.45,49.02 0 top
UP  153.67,21.59 0 top

### Tracks (layer width: path | path; a pad name or v marks a point on that pad's centre or on a via)
32K  (via drill 0.7)
  Top 0.305: v129.54,25.4 JP1.1
  Bottom 0.305: v129.54,25.4 118.11,25.4 114.3,21.59 99.06,21.59 U1.15
!RESET  (via drill 0.7)
  Top 0.406: U1.1 v64.77,12.7 66.04,11.43 68.58,11.43 R1.1 | v91.44,12.7 92.71,12.7 100.33,5.08 104.14,5.08 J1.5
  Bottom 0.406: v91.44,12.7 v64.77,12.7
ADC0  (via drill 0.7)
  Top 0.305: U1.23 77.84,23.23 R2.2
  Top 0.406: U1.23 77.47,20.32 73.66,16.51 73.66,12.7 v72.39,11.43
  Bottom 0.406: v72.39,11.43 72.39,7.62 69.85,5.08 PHOTO_TOP.1
ADC1  (via drill 0.7)
  Top 0.406: U1.24 v69.85,17.78 | PHOTO_INSIDE.1 48.26,5.08 v49.53,6.35 48.26,7.62 48.26,11.43 R4.2
  Bottom 0.406: v49.53,6.35 60.96,17.78 v69.85,17.78
DP0  (via drill 0.7)
  Top 0.406: U1.2 67.31,17.78 v69.85,20.32
  Bottom 0.406: v69.85,20.32 114.3,20.32 118.11,24.13 149.86,24.13 UP.1
DP1  (via drill 0.7)
  Top 0.406: v62.23,11.43 62.23,15.24 64.77,17.78 66.04,17.78 66.04,13.97 67.31,12.7 68.58,12.7 69.85,13.97 U1.3 | v76.2,8.89 v71.12,8.89
  Bottom 0.406: v62.23,11.43 68.58,11.43 v71.12,8.89 | v76.2,8.89 100.33,8.89 104.14,5.08 143.51,5.08 149.86,11.43 DOWN.1
DP2  (via drill 0.7)
  Top 0.406: v72.39,17.78 U1.4
  Bottom 0.406: v72.39,17.78 71.12,19.05 60.96,19.05 52.07,10.16 50.8,10.16 48.26,12.7 17.78,12.7 12.7,7.62 SET.1
GND  (via drill 0.7)
  Top 0.305: 139.95,48.77 TENS1:D7.3 | 64.39,48.77 MTENS:D7.3 | C2.1 C1.1 86.36,10.67 86.36,16.51 85.09,17.78 | C3.2 82.55,14.39 U1.8 82.55,16.51 v83.82,17.78 80.01,21.59 U1.22 79.64,23.23 R2.1 C4.2
  Top 0.406: 54.61,12.7 55.88,13.97 IC1.2 | 54.61,12.7 C6.1 | 50.8,11.43 53.34,11.43 54.61,12.7 | 54.61,12.7 C7.1 | 50.8,11.43 50.8,10.16 v49.53,8.89 | 50.8,11.43 R4.1 | 85.09,17.78 v83.82,17.78 87.63,17.78 88.9,16.51 88.9,12.7 90.17,11.43 90.17,8.89 v92.71,6.35
  Top 0.813: 148.59,39.88 147.83,39.88 TENS1:D10.3 | 148.59,39.88 149.35,40.64 149.35,44.96 147.83,46.48 TENS1:D9.3 147.57,46.99 147.57,48.77 147.32,49.02 ONES1:C8.2 | 140.46,41.66 140.21,41.66 TENS1:D8.3 | 140.46,41.66 141.73,42.93 141.73,46.74 140.21,48.26 TENS1:D7.3 139.95,48.51 138.68,49.78 138.68,50.8 TENS1:C8.2 | TENS1:D6.3 132.59,50.29 134.11,48.77 134.11,44.7 132.84,43.43 | 132.84,43.43 132.59,43.43 TENS1:D5.3 | 132.84,43.43 134.11,42.16 134.11,37.85 132.84,36.58 | 132.84,36.58 132.59,36.32 TENS1:D4.3 | TENS1:D1.3 124.97,52.07 126.49,50.55 126.49,46.48 125.22,45.21 | 125.22,45.21 124.97,45.21 TENS1:D2.3 | 125.22,45.21 126.49,43.94 126.49,39.62 125.48,38.61 | 125.48,38.61 124.97,38.1 TENS1:D3.3 | 140.46,34.54 139.95,34.04 TENS1:C6.2 | 140.46,34.54 141.73,35.81 141.73,40.39 140.46,41.66 | 148.46,33.15 147.57,32.26 TENS1:C7.2 | 148.46,33.15 149.35,34.04 149.35,39.12 148.59,39.88 | 133.1,29.46 132.33,28.7 TENS1:C5.2 | 133.1,29.46 134.11,30.48 134.11,35.31 132.84,36.58 | 125.35,31.37 124.46,30.48 TENS1:C4.2 | 125.35,31.37 126.49,32.51 126.49,37.59 125.48,38.61 | ONES1:D10.3 114.81,51.82 116.33,50.29 116.33,49.02 | 114.81,45.21 ONES1:D9.3 115.07,44.64 | 115.56,44.17 116.33,43.43 116.33,39.62 114.81,38.1 ONES1:D8.3 115.06,37.85 116.08,36.83 | 115.56,44.17 115.07,44.64 | 116.33,49.02 116.33,45.97 115.32,44.96 115.07,44.64 | ONES1:D7.3 107.19,50.29 108.71,48.77 108.71,44.7 107.44,43.43 | 107.44,43.43 107.19,43.43 ONES1:D6.3 | 107.44,43.43 108.71,42.16 108.71,37.85 107.19,36.32 ONES1:D5.3 107.44,36.07 108.71,34.8 108.71,30.23 107.95,29.46 | 99.82,41.66 99.57,41.66 ONES1:D3.3
  Top 0.813: 99.82,41.66 101.09,42.93 101.09,46.99 99.57,48.51 ONES1:D4.3 99.31,48.77 99.31,50.8 ONES1:C6.2 | 99.82,41.66 101.09,40.39 101.09,34.8 100.2,33.91 | 100.2,33.91 100.08,33.78 ONES1:C2.2 | 107.95,29.46 107.19,28.7 ONES1:C3.2 | 115.32,30.99 114.81,30.48 ONES1:C4.2 | 115.32,30.99 116.33,32 116.33,33.02 | 116.33,33.02 116.33,36.58 116.08,36.83 | TENS1:C1.2 116.33,49.02 | ONES1:C5.2 91.44,49.02 91.69,48.77 91.69,46.99 ONES1:D2.3 91.95,46.74 93.47,45.21 93.47,41.4 91.95,39.88 ONES1:D1.3 91.95,39.37 93.47,37.85 93.47,34.04 92.58,33.15 | 92.58,33.15 91.69,32.26 ONES1:C1.2 | TENS1:C3.2 116.33,33.02 | 116.08,36.83 116.84,37.59 ONES1:C7.2 | TENS1:C2.2 116.08,44.7 115.82,44.45 115.56,44.17 | 73.03,39.88 72.26,39.88 MTENS:D10.3 | 73.03,39.88 73.79,40.64 73.79,44.96 72.26,46.48 MTENS:D9.3 72.01,46.99 72.01,48.77 71.75,49.02 MONES:C8.2 | 64.9,41.66 64.64,41.66 MTENS:D8.3 | 64.9,41.66 66.17,42.93 66.17,46.74 64.64,48.26 MTENS:D7.3 64.39,48.51 63.12,49.78 63.12,50.8 MTENS:C8.2 | MTENS:D6.3 57.02,50.29 58.55,48.77 58.55,44.7 57.28,43.43 | 57.28,43.43 57.02,43.43 MTENS:D5.3 | 57.28,43.43 58.55,42.16 58.55,37.85 57.28,36.58 | 57.28,36.58 57.02,36.32 MTENS:D4.3 | MTENS:D1.3 49.4,52.07 50.93,50.55 50.93,46.48 49.66,45.21 | 49.66,45.21 49.4,45.21 MTENS:D2.3 | 49.66,45.21 50.93,43.94 50.93,39.62 49.91,38.61 | 49.91,38.61 49.4,38.1 MTENS:D3.3 | 65.09,34.73 64.39,34.04 MTENS:C6.2 | 65.09,34.73 66.17,35.81 66.17,40.39 64.9,41.66 | 72.58,32.83 72.01,32.26 MTENS:C7.2 | 72.58,32.83 73.79,34.04 73.79,39.12 73.03,39.88 | 57.72,29.65 56.77,28.7 MTENS:C5.2 | 57.72,29.65 58.55,30.48 58.55,35.31 57.28,36.58
  Top 0.813: 49.59,31.18 48.9,30.48 MTENS:C4.2 | 49.59,31.18 50.93,32.51 50.93,37.59 49.91,38.61 | MONES:D10.3 39.24,51.82 40.77,50.29 40.77,49.02 | 39.24,45.21 MONES:D9.3 39.51,44.64 | 39.99,44.17 40.77,43.43 40.77,39.62 39.24,38.1 MONES:D8.3 39.5,37.85 40.51,36.83 | 39.99,44.17 39.51,44.64 | 40.77,49.02 40.77,45.97 39.75,44.96 39.51,44.64 | MONES:D7.3 31.62,50.29 33.15,48.77 33.15,44.7 31.88,43.43 | 31.88,43.43 31.62,43.43 MONES:D6.3 | 31.88,43.43 33.15,42.16 33.15,37.85 31.62,36.32 MONES:D5.3 31.88,36.07 33.15,34.8 33.15,30.23 32.32,29.4 | 24.26,41.66 24,41.66 MONES:D3.3 | 24.26,41.66 25.53,42.93 25.53,46.99 24,48.51 MONES:D4.3 23.75,48.77 23.75,50.8 MONES:C6.2 | 24.26,41.66 25.53,40.39 25.53,34.8 24.51,33.78 | 32.32,29.4 31.62,28.7 MONES:C3.2 | 39.69,30.92 39.24,30.48 MONES:C4.2 | 39.69,30.92 40.77,32 40.77,33.02 | 40.77,33.02 40.77,36.58 40.51,36.83 | MTENS:C1.2 40.77,49.02 | MONES:C5.2 15.88,49.02 16.13,48.77 16.13,46.99 MONES:D2.3 16.38,46.74 17.91,45.21 17.91,41.4 16.38,39.88 MONES:D1.3 16.38,39.37 17.91,37.85 17.91,34.04 16.95,33.08 | 16.95,33.08 16.13,32.26 MONES:C1.2 | MTENS:C3.2 40.77,33.02 | 40.51,36.83 41.27,37.59 MONES:C7.2 | MTENS:C2.2 40.51,44.7 40.26,44.45 39.99,44.17 | v17.78,31.75 17.78,32.26 16.95,33.08 | v24.89,31.75 24.89,32.89 24.51,33.78 | v33.02,27.94 33.02,28.7 32.32,29.4 | v40.64,29.21 40.64,29.97 39.69,30.92 | v50.8,29.21 50.8,29.97 49.59,31.18 | v58.42,27.94 58.42,28.96 57.72,29.65 | v66.04,33.02 66.04,33.78 65.09,34.73 | v73.66,30.48 73.66,31.75 72.58,32.83 | v93.98,31.75 92.58,33.15 | v100.33,31.75 100.33,33.78 100.2,33.91 | v109.22,27.94 109.22,28.19 107.95,29.46
  Top 0.813: v116.84,29.21 116.84,29.46 115.32,30.99 | v126.49,29.46 126.49,30.23 125.35,31.37 | v134.62,27.94 133.1,29.46 | v141.48,32.77 141.48,33.53 140.46,34.54 | v149.61,31.24 149.61,32 148.46,33.15 | 24.51,33.78 MONES:C2.2
  pour Bottom (isolate 0.61): 0,1.27 0,54.61 160.02,54.61 160.02,1.27
M_ONES_OUT  (via drill 0.7)
  Top 0.305: v16.51,36.83 16.51,35.56 MONES:D1.2 | v144.78,38.1 144.78,39.37 TENS1:D10.4
  Bottom 0.305: v16.51,36.83 20.32,36.83 24.13,33.02 29.21,33.02 30.48,31.75 36.83,31.75 57.15,52.07 130.81,52.07 v144.78,38.1
M_TENS_IN  (via drill 0.7)
  Top 0.406: v69.85,36.83 69.85,38.1 68.58,39.37 MTENS:D10.4 | v88.9,27.94 90.17,26.67 R3.2
  Bottom 0.406: v69.85,36.83 78.74,27.94 v88.9,27.94
MISO
  Top 0.305: U1.18 96.52,16.51 96.52,12.7 100.33,8.89 J1.1
MONES:N$1  (via drill 0.7 pad 0.61)
  Top 0.305: v22.23,36.58 23.75,36.58 MONES:D3.2 | v13.08,45.21 13.08,46.48 MONES:D2.4
  Bottom 0.305: v22.23,36.58 21.72,36.58 v13.08,45.21
MONES:N$5
  Top 0.305: MONES:D1.4 13.08,39.88 13.84,39.88 16.13,42.16 16.38,41.91 MONES:D2.2
MONES:N$6
  Top 0.305: MONES:D3.4 20.7,41.66 21.46,41.66 23.75,43.94 24,43.69 MONES:D4.2
MONES:N$7  (via drill 0.7 pad 0.61)
  Top 0.305: v31.37,33.53 31.37,31.5 MONES:D5.2 | v19.43,45.47 19.43,46.23 20.7,47.5 20.7,48.26 MONES:D4.4
  Bottom 0.305: v19.43,45.47 v31.37,33.53
MONES:N$9
  Top 0.305: MONES:D5.4 28.32,36.32 29.08,36.32 31.37,38.61 31.62,38.35 MONES:D6.2
MONES:N$10
  Top 0.305: MONES:D6.4 28.32,43.43 29.08,43.43 31.37,45.72 31.62,45.47 MONES:D7.2
MONES:N$12  (via drill 0.7 pad 0.61)
  Top 0.305: v38.99,35.31 38.99,33.27 MONES:D8.2 | v28.57,47.75 28.32,48.01 28.32,50.04 MONES:D7.4
  Bottom 0.305: v38.99,35.31 38.99,37.34 v28.57,47.75
MONES:N$13
  Top 0.305: MONES:D8.4 35.94,38.1 36.7,38.1 38.99,40.39 39.24,40.13 MONES:D9.2
MONES:N$15
  Top 0.305: MONES:D9.4 35.94,45.21 36.7,45.21 38.99,47.5 39.24,47.24 MONES:D10.2
MOSI
  Top 0.305: U1.17 100.33,15.24 102.87,15.24 105.41,12.7 J1.4
MTENS:N$1
  Top 0.305: MTENS:D3.2 49.15,33.27 49.15,35.31 47.62,36.83 47.62,41.66 46.1,43.18 46.1,44.96 MTENS:D2.4
MTENS:N$5
  Top 0.305: MTENS:D2.2 49.15,40.13 49.15,42.16 47.62,43.69 47.62,48.51 46.1,50.04 46.1,51.82 MTENS:D1.4
MTENS:N$6  (via drill 0.7 pad 0.61)
  Top 0.305: v55.24,31.5 56.77,31.5 MTENS:D4.2 | v46.61,36.32 46.1,36.83 46.1,37.85 MTENS:D3.4
  Bottom 0.305: v55.24,31.5 51.44,31.5 v46.61,36.32
MTENS:N$7
  Top 0.305: MTENS:D4.4 53.72,36.32 54.48,36.32 56.77,38.61 57.02,38.35 MTENS:D5.2
MTENS:N$9
  Top 0.305: MTENS:D5.4 53.72,43.43 54.48,43.43 56.77,45.72 57.02,45.47 MTENS:D6.2
MTENS:N$10
  Top 0.305: MTENS:D7.2 64.39,43.69 64.39,45.72 62.87,47.24 62.87,48.77 61.85,49.78 61.09,49.78 58.8,52.07 55.5,52.07 53.72,50.29 MTENS:D6.4
MTENS:N$12
  Top 0.305: MTENS:D8.2 64.39,36.58 64.39,38.1 62.87,39.62 62.87,44.7 61.34,46.23 61.34,48.26 MTENS:D7.4
MTENS:N$13  (via drill 0.7)
  Top 0.305: v62.23,38.1 62.23,40.64 60.96,41.91 MTENS:D8.4 | v71.12,44.45 72.39,43.18 72.39,41.91 MTENS:D9.2
  Bottom 0.305: v62.23,38.1 64.77,38.1 v71.12,44.45
MTENS:N$15
  Top 0.305: MTENS:D10.2 72.01,35.05 72.01,36.83 70.48,38.35 70.48,42.93 68.96,44.45 68.96,46.48 MTENS:D9.4
N$1  (via drill 0.7 pad 0.61)
  Top 0.305: v48.64,48.77 49.15,48.26 49.15,47.24 MTENS:D1.2 | v38.48,48.77 35.94,51.31 35.94,51.82 MONES:D10.4
  Bottom 0.305: v38.48,48.77 v48.64,48.77
N$2
  Top 0.305: U1.12 92.71,16.51 88.9,20.32 87.63,20.32 86.36,21.59 86.36,24.13 88,25.77 R3.1
N$6  (via drill 0.7 pad 0.61)
  Top 0.305: v124.21,48.77 124.71,48.26 124.71,47.24 TENS1:D1.2 | v114.05,48.77 111.51,51.31 111.51,51.82 ONES1:D10.4
  Bottom 0.305: v114.05,48.77 v124.21,48.77
N$17
  Top 0.305: U1.9 85.09,13.97 83.4,12.28 C1.2 82.13,12.28 81.28,11.43 81.28,7.62 Q1.2
N$18
  Top 0.305: U1.10 C2.2 88.05,12.28 88.9,11.43 88.9,7.62 Q1.1
ONES1:N$1  (via drill 0.7 pad 0.61)
  Top 0.305: v97.79,36.58 99.31,36.58 ONES1:D3.2 | v88.65,45.21 88.65,46.48 ONES1:D2.4
  Bottom 0.305: v97.79,36.58 97.28,36.58 v88.65,45.21
ONES1:N$5
  Top 0.305: ONES1:D1.4 88.65,39.88 89.41,39.88 91.69,42.16 91.95,41.91 ONES1:D2.2
ONES1:N$6
  Top 0.305: ONES1:D3.4 96.27,41.66 97.03,41.66 99.31,43.94 99.57,43.69 ONES1:D4.2
ONES1:N$7  (via drill 0.7 pad 0.61)
  Top 0.305: v106.93,33.53 106.93,31.5 ONES1:D5.2 | v95,45.47 95,46.23 96.27,47.5 96.27,48.26 ONES1:D4.4
  Bottom 0.305: v95,45.47 v106.93,33.53
ONES1:N$9
  Top 0.305: ONES1:D5.4 103.89,36.32 104.65,36.32 106.93,38.61 107.19,38.35 ONES1:D6.2
ONES1:N$10
  Top 0.305: ONES1:D6.4 103.89,43.43 104.65,43.43 106.93,45.72 107.19,45.47 ONES1:D7.2
ONES1:N$12  (via drill 0.7 pad 0.61)
  Top 0.305: v114.55,35.31 114.55,33.27 ONES1:D8.2 | v104.14,47.75 103.89,48.01 103.89,50.04 ONES1:D7.4
  Bottom 0.305: v114.55,35.31 114.55,37.34 v104.14,47.75
ONES1:N$13
  Top 0.305: ONES1:D8.4 111.51,38.1 112.27,38.1 114.55,40.39 114.81,40.13 ONES1:D9.2
ONES1:N$15
  Top 0.305: ONES1:D9.4 111.51,45.21 112.27,45.21 114.55,47.5 114.81,47.24 ONES1:D10.2
SCK
  Top 0.305: U1.19 93.98,16.51 93.98,12.7 100.33,6.35 102.87,6.35 J1.3
SCL  (via drill 0.7)
  Top 0.406: v67.31,25.4 U1.28 | v88.9,25.4 118.11,25.4 125.73,17.78 JP1.3
  Bottom 0.406: v88.9,25.4 v67.31,25.4
SDA  (via drill 0.7)
  Top 0.406: v130.81,16.51 JP1.4 | v128.27,19.05 125.73,19.05 118.11,26.67 v91.44,26.67 | U1.27 v71.12,26.67
  Bottom 0.406: v128.27,19.05 v130.81,16.51 | v71.12,26.67 v91.44,26.67
SQW  (via drill 0.7)
  Top 0.406: v74.93,11.43 U1.5
  Bottom 0.406: v74.93,11.43 100.33,11.43 105.41,16.51 123.19,16.51 127,20.32 JP1.2
TENS1:N$1
  Top 0.305: TENS1:D3.2 124.71,33.27 124.71,35.31 123.19,36.83 123.19,41.66 121.67,43.18 121.67,44.96 TENS1:D2.4
TENS1:N$5
  Top 0.305: TENS1:D2.2 124.71,40.13 124.71,42.16 123.19,43.69 123.19,48.51 121.67,50.04 121.67,51.82 TENS1:D1.4
TENS1:N$6  (via drill 0.7 pad 0.61)
  Top 0.305: v130.81,31.5 132.33,31.5 TENS1:D4.2 | v122.17,36.32 121.67,36.83 121.67,37.85 TENS1:D3.4
  Bottom 0.305: v130.81,31.5 127,31.5 v122.17,36.32
TENS1:N$7
  Top 0.305: TENS1:D4.4 129.29,36.32 130.05,36.32 132.33,38.61 132.59,38.35 TENS1:D5.2
TENS1:N$9
  Top 0.305: TENS1:D5.4 129.29,43.43 130.05,43.43 132.33,45.72 132.59,45.47 TENS1:D6.2
TENS1:N$10
  Top 0.305: TENS1:D7.2 139.95,43.69 139.95,45.72 138.43,47.24 138.43,48.77 137.41,49.78 136.65,49.78 134.37,52.07 131.06,52.07 129.29,50.29 TENS1:D6.4
TENS1:N$12
  Top 0.305: TENS1:D8.2 139.95,36.58 139.95,38.1 138.43,39.62 138.43,44.7 136.91,46.23 136.91,48.26 TENS1:D7.4
TENS1:N$13  (via drill 0.7)
  Top 0.305: v137.16,39.37 137.16,41.91 TENS1:D8.4 | v146.05,44.45 147.32,43.18 147.32,41.91 TENS1:D9.2
  Bottom 0.305: v137.16,39.37 140.97,39.37 143.51,36.83 146.05,36.83 v146.05,44.45
TENS1:N$15
  Top 0.305: TENS1:D10.2 147.57,35.05 147.57,36.83 146.05,38.35 146.05,42.93 144.53,44.45 144.53,46.48 TENS1:D9.4
VCC
  Top 0.406: IC1.1 53.34,15.24 53.34,13.97 52.07,12.7 C7.2
  Top 0.813: ONES1:C4.1 112.27,30.48 | 111.51,32.77 ONES1:D8.1 | 45.34,33.27 45.85,33.27 MTENS:D3.1 46.1,32.77 | 20.7,36.32 MONES:D3.1 | 13.08,34.54 MONES:D1.1 | 46.86,30.48 MTENS:C4.1
  pour Top (isolate 0.61): 0,0 0,54.61 160.02,54.61 160.02,53.34 160.02,0
VSS  (via drill 0.7)
  Top 0.406: 77.47,11.43 80.01,13.97 U1.7 81.28,16.51 81.28,19.05 78.74,21.59 78.74,27.94 80.01,29.21 82.55,29.21 85.09,26.67 | 85.09,26.67 C4.1 | 85.09,26.67 U1.20 | 58.42,12.7 58.42,15.24 IC1.3 | 58.42,12.7 60.96,10.16 67.31,10.16 | 67.31,10.16 71.12,10.16 | 71.12,10.16 76.2,10.16 77.47,11.43 | 71.12,10.16 71.12,11.43 R1.2 | 67.31,10.16 67.31,5.08 PHOTO_TOP.2 | 58.42,12.7 50.8,5.08 PHOTO_INSIDE.2 | v78.74,10.16 77.47,11.43 | 77.47,11.43 C3.1 | 58.42,12.7 C6.2
  Bottom 0.406: v78.74,10.16 101.6,10.16 J1.2 106.68,15.24 128.27,15.24 130.81,12.7 JP1.5 | SUPPLY_BYPASS.1 50.98,5.13 PHOTO_INSIDE.2

### Text on the board
tPlace: +5V CENTER POSITIVE | UP | 32K | ATMEGA328P | 1000uF | DOWN | SET | REAL TIME CLOCK | GND | BYPASS | EYE TOP | EYE INSIDE | Owl Clock | V2.0
bPlace: /Users/kschaefer/Documents/owl-clock/owlLogoMono3.BMP